# EAGLE design hexciliaSMD (1) (EAGLE 7.3.0)
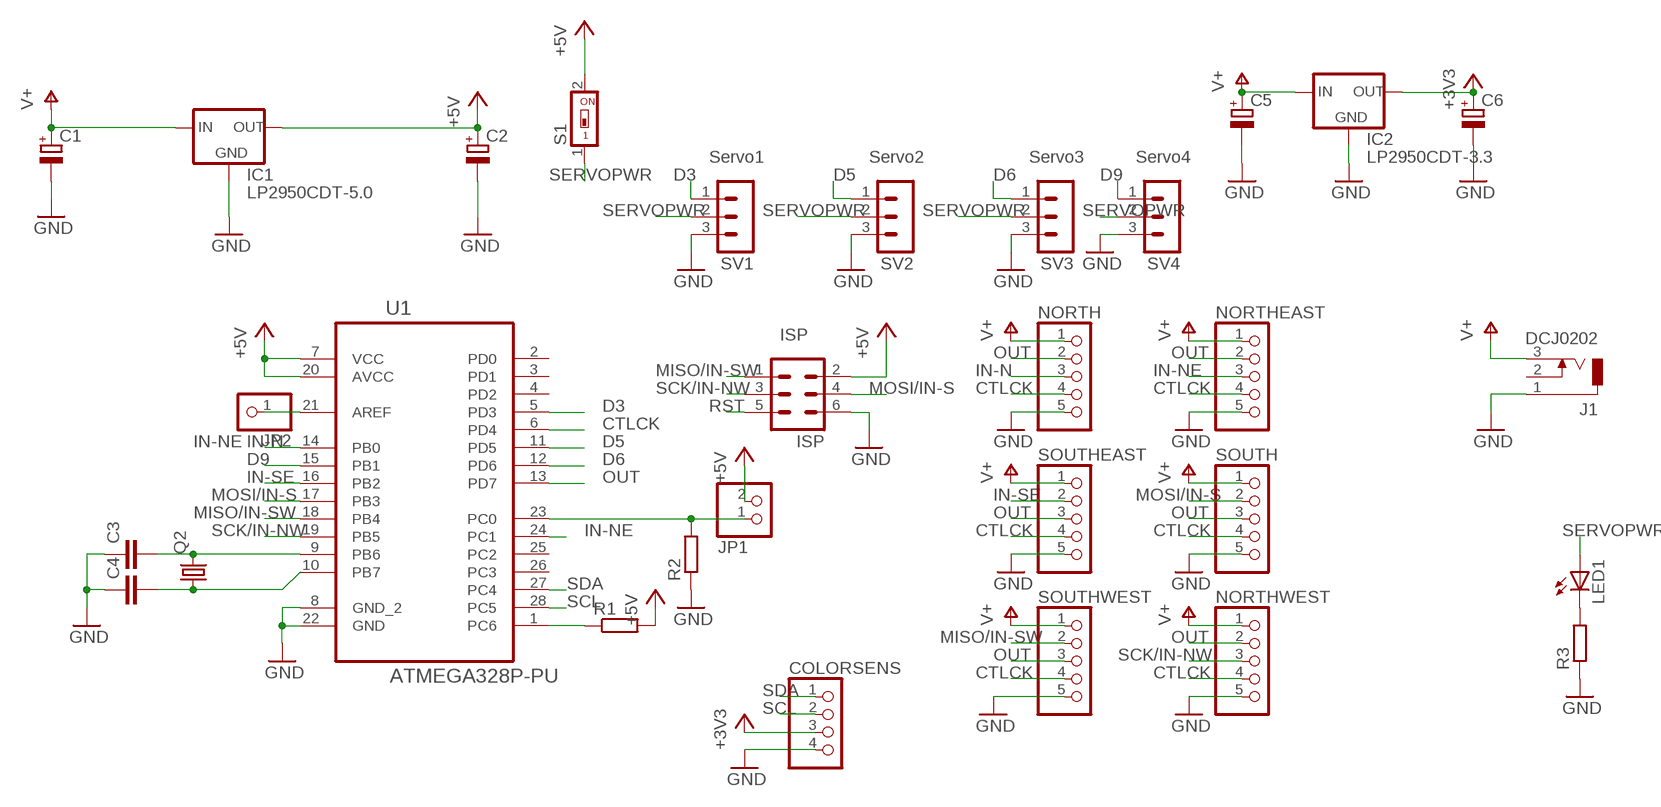
[diagram p0: schematic, sheet 1]

## Parts
C1  CPOL-EU153CLV-0605  [153CLV-0605]
C2  CPOL-EU153CLV-0605  [153CLV-0605]
C3  C-EUC1210  [C1210]
C4  C-EUC1210  [C1210]
C5  CPOL-EU153CLV-0605  [153CLV-0605]
C6  CPOL-EU153CLV-0605  [153CLV-0605]
COLORSENS  PINHD-1X4  [1X04]
IC1  LP2950CDT-5.0  [DPACK]
IC2  LP2950CDT-3.3  [DPACK]
ISP  MA03-2  [MA03-2]
J1  DCJ0202  [DCJ0202]
JP1  PINHD-1X2  [1X02]
JP2  PINHD-1X1  [1X01]
LED1  LEDCHIP-LED0805  [CHIP-LED0805]
NORTH  PINHD-1X5  [1X05]
NORTHEAST  PINHD-1X5  [1X05]
NORTHWEST  PINHD-1X5  [1X05]
Q2  CRYSTALHC49UP  [HC49UP]
R1  R-EU_M1206  [M1206]
R2  R-EU_M1206  [M1206]
R3  R-EU_M1206  [M1206]
S1  SWS001  [SMS-001]
SOUTH  PINHD-1X5  [1X05]
SOUTHEAST  PINHD-1X5  [1X05]
SOUTHWEST  PINHD-1X5  [1X05]
SV1  MA03-1  [MA03-1]
SV2  MA03-1  [MA03-1]
SV3  MA03-1  [MA03-1]
SV4  MA03-1  [MA03-1]
U1  ATMEGA328P-PU  [DIP254P762X457-28]

## Nets
+3V3: C6.+ COLORSENS.3 IC2.3(OUT)
+5V: C2.+ IC1.3(OUT) ISP.2 JP1.2 R1.2 S1.2 U1.7(VCC) U1.20(AVCC)
CONTROLCK: NORTH.4 NORTHEAST.4 NORTHWEST.4 SOUTH.4 SOUTHEAST.4 SOUTHWEST.4 U1.6(PD4)
CTLCHK: JP1.1 R2.2 U1.23(PC0)
D3: SV1.1 U1.5(PD3)
D5: SV2.1 U1.11(PD5)
D6: SV3.1 U1.12(PD6)
D9: SV4.1 U1.15(PB1)
GND: C1.- C2.- C3.1 C4.1 C5.- C6.- COLORSENS.4 IC1.4(GND) IC2.4(GND) ISP.6 J1.1 NORTH.5 NORTHEAST.5 NORTHWEST.5 R2.1 R3.1 SOUTH.5 SOUTHEAST.5 SOUTHWEST.5 SV1.3 SV2.3 SV3.3 SV4.3 U1.8(GND_2) U1.22(GND)
IN-N: NORTH.3 U1.14(PB0)
IN-NE: NORTHEAST.3 U1.24(PC1)
IN-SE: SOUTHEAST.2 U1.16(PB2)
MISO/IN-SW: ISP.1 SOUTHWEST.2 U1.18(PB4)
MOSI/IN-S: ISP.4 SOUTH.2 U1.17(PB3)
N$1: JP2.1 U1.21(AREF)
N$2: LED1.C R3.2
N$3: C3.2 Q2.2 U1.9(PB6)
N$4: C4.2 Q2.1 U1.10(PB7)
OUT: NORTH.2 NORTHEAST.2 NORTHWEST.2 SOUTH.3 SOUTHEAST.3 SOUTHWEST.3 U1.13(PD7)
RST: ISP.5 R1.1 U1.1(PC6)
SCK/IN-NW: ISP.3 NORTHWEST.3 U1.19(PB5)
SCL: COLORSENS.2 U1.28(PC5)
SDA: COLORSENS.1 U1.27(PC4)
SWPWR: LED1.A S1.1 SV1.2 SV2.2 SV3.2 SV4.2
V+: C1.+ C5.+ IC1.1(IN) IC2.1(IN) J1.3 NORTH.1 NORTHEAST.1 NORTHWEST.1 SOUTH.1 SOUTHEAST.1 SOUTHWEST.1
Unconnected: J1.2 U1.2(PD0) U1.3(PD1) U1.4(PD2) U1.25(PC2) U1.26(PC3)

## Notes on the sheet
- Servo1 | Servo2 | Servo3 | Servo4
- SERVOPWR | D3 | D5 | D6 | D9
- SERVOPWR | SERVOPWR | SERVOPWR | SERVOPWR
- ISP
- OUT | OUT
- MISO/IN-SW | IN-N | IN-NE
- SCK/IN-NW | MOSI/IN-S | CTLCK | CTLCK
- D3 | RST
- CTLCK
- IN-NE | IN-N | D5
- D9 | D6
- IN-SE | OUT
- MOSI/IN-S | IN-SE | MOSI/IN-S
- MISO/IN-SW | OUT | OUT
- SCK/IN-NW | IN-NE | CTLCK | CTLCK | SERVOPWR
- SDA
- SCL
- MISO/IN-SW | OUT
- OUT | SCK/IN-NW
- CTLCK | CTLCK
- SDA
- SCL

## Library data of the parts
C1 C2 C5 C6 = rcl:CPOL-EU: POLARIZED CAPACITOR, European symbol
C3 C4 = rcl:C-EU: CAPACITOR, European symbol
COLORSENS = pinhead:PINHD-1X4: PIN HEADER
IC1 IC2 = v-reg:LP2950?*: Source: http://cache.national.com/ds/LP/LP2950.pdf
ISP = con-lstb:MA03-2: PIN HEADER; OC_FARNELL: unknown; OC_NEWARK: unknown
J1 = con-jack:DCJ0202: DC POWER JACK Source: DCJ0202.pdf; OC_FARNELL: unknown; OC_NEWARK: unknown
JP1 = pinhead:PINHD-1X2: PIN HEADER
JP2 = pinhead:PINHD-1X1: PIN HEADER
LED1 = led:LED: LED OSRAM: - CHIPLED LG R971, LG N971, LY N971, LG Q971, LY Q971, LO R971, LY R971 LH N974, LH R974 LS Q976, LO Q976, LY Q976 LO Q996 - Hyper CHIPLED LW Q18S LB Q993, LB Q99A, LB R99A - SideLED LS A670, LO A670, LY A670, LG A670, LP A670 LB A673, LV A673, LT A673, LW A673 LH A674 LY A675 LS A676, LA A676, LO A676, LY A676, LW A676 LS A679, LY A679, LG A679 - Hyper Micro SIDELED® LS Y876, LA Y876, LO Y876, LY Y876 LT Y87S - SmartLED LW L88C, LW L88S LB L89C, LB L89S, LG L890 LS L89K, LO L89K, LY L89K LS L896, LA L896, LO L896, LY L896 - TOPLED LS T670, LO T670, LY T670, LG T670, LP T670 LSG T670, LSP T670, LSY T670, LOP T670, LYG T670 LG T671, LOG T671, LSG T671 LB T673, LV T673, LT T673, LW T673 LH T674 LS T676, LA T676, LO T676, LY T676, LB T676, LH T676, LSB T676, LW T676 LB T67C, LV T67C, LT T67C, LS T67K, LO T67K, LY T67K, LW E67C LS E67B, LA E67B, LO E67B, LY E67B, LB E67C, LV E67C, LT E67C LW T67C LS T679, LY T679, LG T679 LS T770, LO T770, LY T770, LG T770, LP T770 LB T773, LV T773, LT T773, LW T773 LH T774 LS E675, LA E675, LY E675, LS T675 LS T776, LA T776, LO T776, LY T776, LB T776 LHGB T686 LT T68C, LB T68C - Hyper Mini TOPLED® LB M676 - Mini TOPLED Santana® LG M470 LS M47K, LO M47K, LY M47K Source: http://www.osram.convergy.de LUXEON: - LUMILED® LXK2-PW12-R00, LXK2-PW12-S00, LXK2-PW14-U00, LXK2-PW14-V00 LXK2-PM12-R00, LXK2-PM12-S00, LXK2-PM14-U00 LXK2-PE12-Q00, LXK2-PE12-R00, LXK2-PE12-S00, LXK2-PE14-T00, LXK2-PE14-U00 LXK2-PB12-K00, LXK2-PB12-L00, LXK2-PB12-M00, LXK2-PB14-N00, LXK2-PB14-P00, LXK2-PB14-Q00 LXK2-PR12-L00, LXK2-PR12-M00, LXK2-PR14-Q00, LXK2-PR14-R00 LXK2-PD12-Q00, LXK2-PD12-R00, LXK2-PD12-S00 LXK2-PH12-R00, LXK2-PH12-S00 LXK2-PL12-P00, LXK2-PL12-Q00, LXK2-PL12-R00 Source: www.luxeon.com KINGBRIGHT: KA-3528ASYC Source: www.kingbright.com
NORTH NORTHEAST NORTHWEST SOUTH SOUTHEAST SOUTHWEST = pinhead:PINHD-1X5: PIN HEADER
Q2 = crystal:CRYSTAL: CRYSTAL; OC_FARNELL: unknown; OC_NEWARK: unknown
R1-R3 = resistor:R-EU_: RESISTOR, European symbol
S1 = smd-special:SWS001: SMD Dip Switch 1 pol.
SV1-SV4 = con-lstb:MA03-1: PIN HEADER; OC_FARNELL: unknown; OC_NEWARK: unknown
U1 = Atmel_By_element14_Batch_1-00:ATMEGA328P-PU: 8-bit Microcontroller with In-System Programmable Flash; MPN: ATMEGA328P-PU; OC_FARNELL: 1715487; OC_NEWARK: 15R0268; PACKAGE: PDIP-28; SUPPLIER: Atmel

## Board
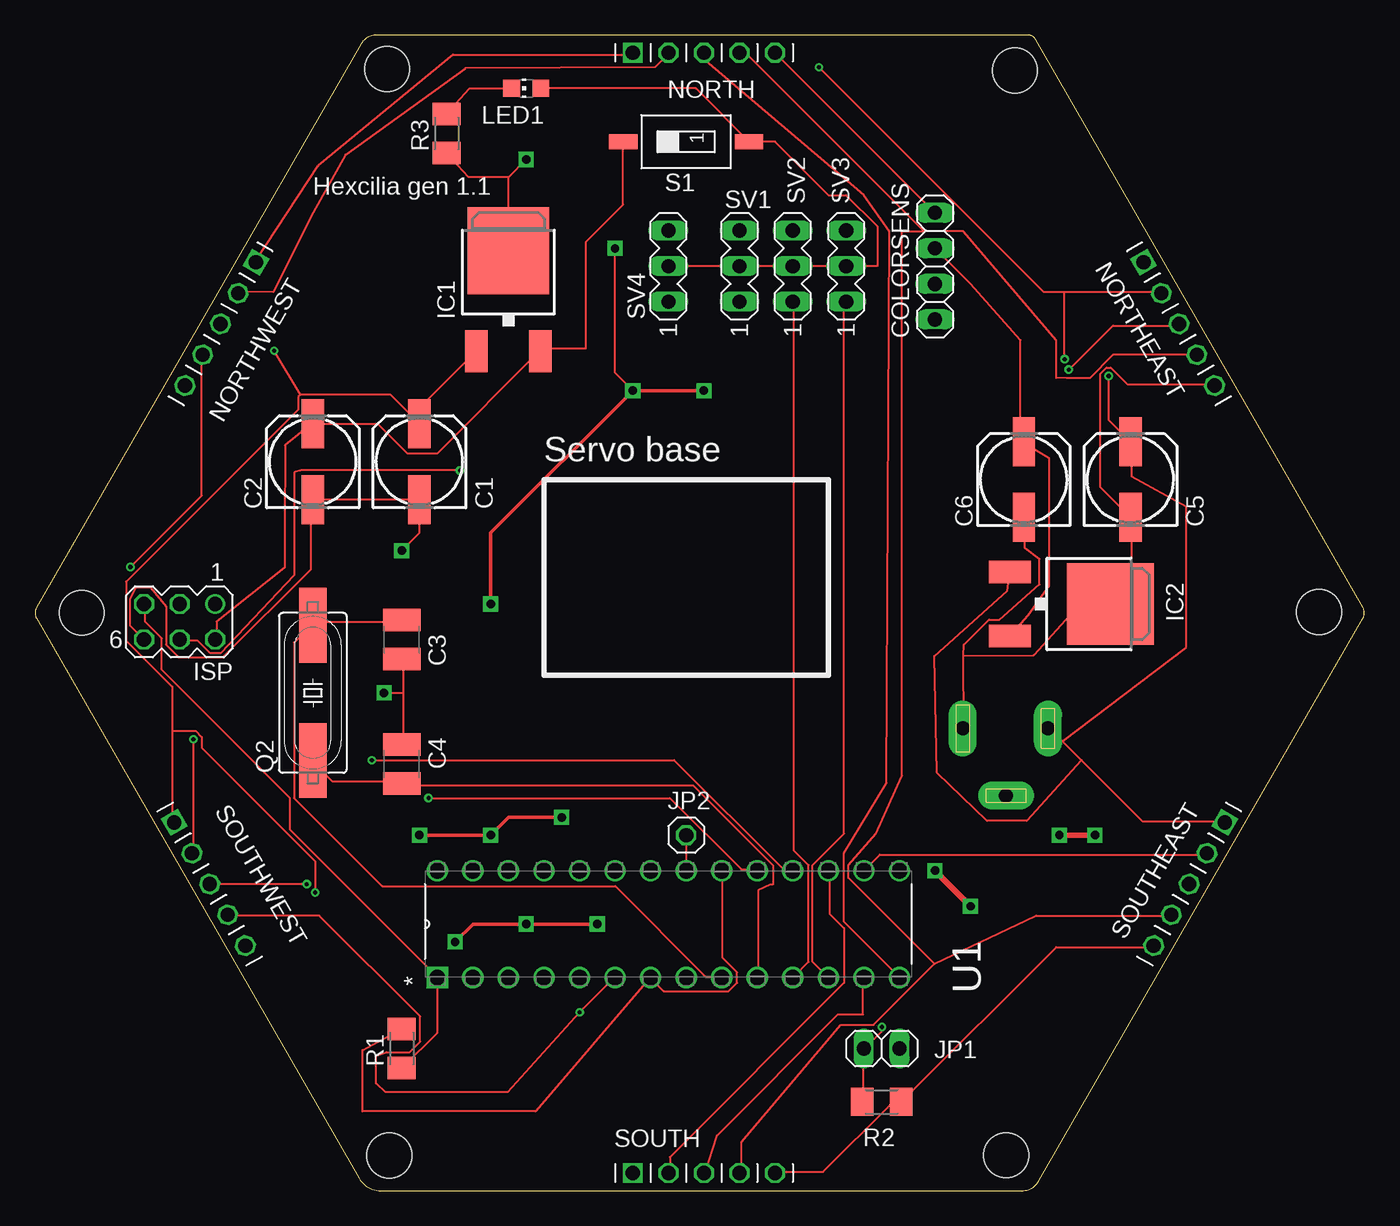
[diagram p1: board, top side]
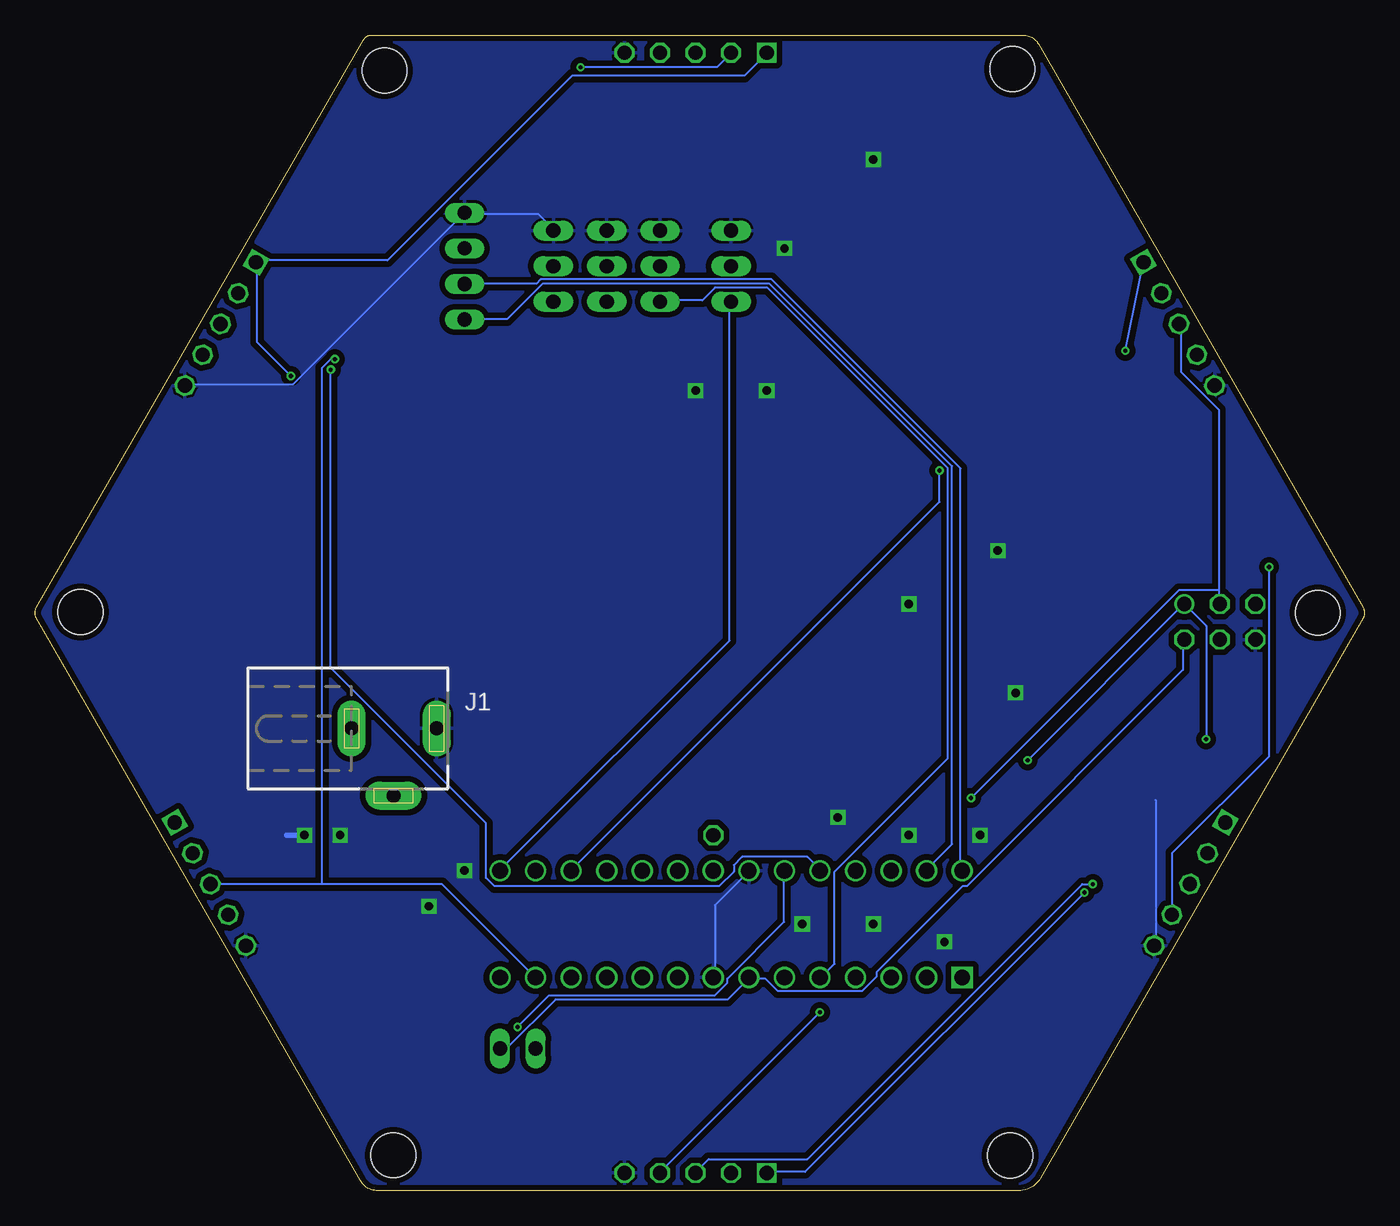
[diagram p2: board, bottom side, seen from below]

Size 95 x 82.55 mm. Coordinates in mm from the lower left corner, seen from the top.
Outline: 71.74,0.72 94.9,40.92 arc60 94.9,41.63 71.52,82.21 arc60 70.94,82.55 24.4,82.55 arc60 23.3,81.91 0.1,41.64 arc60 0.1,40.91 23.15,0.9 arc60 24.7,0 70.5,0 arc60 71.74,0.72
Copper layers (1+2*15+16): Top 0.035mm / dielectric 0.38mm / layer 2 0.035mm / dielectric 0.71mm / layer 15 0.035mm / dielectric 0.38mm / Bottom 0.035mm
Design rules "PCB-POOL Standard_ML4": minimum track width 0.15mm, minimum drill 0.3mm, track to track 0.15mm, track to pad 0.15mm, pad to pad 0.15mm, via to via 0.15mm, smd to smd 0.15mm, copper to edge 0.3mm, drill to drill 0.2mm, minimum pad ring 0.2mm, minimum via ring 0.15mm, stop-mask expansion 0.075mm, vias tented up to drill 0mil, thermal gap 0.2mm
Holes 3.2 mm at 3.35,41.27 69.39,2.54 70.02,80.01 25.16,80.12 91.74,41.34 25.32,2.52

### Footprints (pad centres in the part's own frame; a part is rotated, then mirrored left to right if it is on the bottom)
153CLV-0605 = smd 3.5 x 1.6: + 2.7,0; - -2.7,0
C1210 = smd 1.6 x 2.7: 1 -1.4,0; 2 1.4,0
1X04 = drill 1.016 long: 1 -3.81,0; 2 -1.27,0; 3 1.27,0; 4 3.81,0
DPACK = smd 1.6 x 3: 1 -2.28,-4.8; 3 2.28,-4.8 | smd 5.8 x 6.2: 4 0,2.38
MA03-2 = drill 1.016: 1 -2.54,-1.27 | drill 1.016 octagon: 2 -2.54,1.27; 3 0,-1.27; 4 0,1.27; 5 2.54,-1.27; 6 2.54,1.27
DCJ0202 = drill 1 pad 2 long: 1 0,3.1; 2 4.8,0; 3 0,-3
1X02 = drill 1.016 long: 1 -1.27,0; 2 1.27,0
1X01 = drill 1.016 octagon: 1 0,0
CHIP-LED0805 = smd 1.2 x 1.2: A 0,-1.05; C 0,1.05
1X05 = drill 1.016 square: 1 -5.08,0 | drill 1.016 octagon: 2 -2.54,0; 3 0,0; 4 2.54,0; 5 5.08,0
HC49UP = smd 5.334 x 1.93: 1 -4.826,0; 2 4.826,0
M1206 = smd 1.6 x 2: 1 -1.4,0; 2 1.4,0
SMS-001 = smd 1.092 x 2.007: 1 0,-4.496; 2 0,4.496
MA03-1 = drill 1.016 long: 1 -2.54,0; 2 0,0; 3 2.54,0
DIP254P762X457-28 = drill 1.118 square: 1 -7.62,33.02 | drill 1.118: 2 -7.62,30.48; 3 -7.62,27.94; 4 -7.62,25.4; 5 -7.62,22.86; 6 -7.62,20.32; 7 -7.62,17.78; 8 -7.62,15.24; 9 -7.62,12.7; 10 -7.62,10.16; 11 -7.62,7.62; 12 -7.62,5.08; 13 -7.62,2.54; 14 -7.62,0; 15 0,0; 16 0,2.54; 17 0,5.08; 18 0,7.62; 19 0,10.16; 20 0,12.7; 21 0,15.24; 22 0,17.78; 23 0,20.32; 24 0,22.86; 25 0,25.4; 26 0,27.94; 27 0,30.48; 28 0,33.02

### Placement (x,y rotation side)
C1  27.48,52.07 90 top
C2  19.86,52.07 90 top
C3  26.21,39.37 90 top
C4  26.21,30.48 270 top
C5  78.28,50.8 90 top
C6  70.66,50.8 90 top
COLORSENS  64.31,66.04 90 top
IC1  33.83,64.77 0 top
IC2  74.47,41.91 270 top
ISP  10.33,40.64 180 top
J1  69.39,33.02 270 bottom
JP1  60.5,10.16 0 top
JP2  46.53,25.4 0 top
LED1  35.1,78.74 90 top
NORTH  47.8,81.28 0 top
NORTHEAST  81.74,61.91 300 top
NORTHWEST  13.25,61.91 240 top
Q2  19.86,35.56 90 top
R1  26.21,10.16 90 top
R2  60.5,6.35 180 top
R3  29.42,75.52 90 top
S1  46.53,74.93 90 top
SOUTH  47.8,1.27 0 top
SOUTHEAST  82.47,21.91 240 top
SOUTHWEST  12.49,21.91 300 top
SV1  50.34,66.04 90 top
SV2  54.15,66.04 90 top
SV3  57.96,66.04 90 top
SV4  45.26,66.04 90 top
U1  61.77,22.86 90 top

### Tracks (layer width: path | path; a pad name or v marks a point on that pad's centre or on a via)
+3V3
  Top 0.15: COLORSENS.3 64.42,67.2 64.42,66.75 64.87,66.75 66.85,64.77 70.42,60.75 70.42,53.7 C6.+ 70.72,53.4 72.45,52.35 72.45,43.2 70.94,41.1 IC2.3
  Top 0.254: 70.73,53.49 C6.+ 70.5,53.72
+5V
  Top 0.15: R1.2 26.17,11.55 23.4,10.05 23.4,7.65 23.39,5.67 35.76,5.67 43.87,15.15 U1.7 44.02,15.15 44.92,14.25 49.57,14.25 50.17,14.85 50.17,15.6 49.12,16.65 49.12,22.8 U1.20 | ISP.2 12.97,39.45 12.97,40.65 17.83,44.51 17.84,46.2 17.84,47.18 17.86,53.25 19.72,54.75 C2.+ 19.87,54.75 24.52,54.75 26.62,52.65 28.72,52.65 35.92,59.85 IC1.3 36.22,60.15 39.37,60.15 39.37,67.77 42.03,70.43 S1.2
  Top 0.254: 36.21,60.12 IC1.3 35.99,59.89
  Bottom 0.15: JP1.2 61.72,10.2 61.27,10.2 57.82,13.65 45.52,13.65 44.02,15.15 U1.7 43.87,15.15 42.82,15.15 41.92,14.25 35.92,14.25 34.87,15.3 34.87,15.6 28.72,21.75 28.42,21.75 12.97,37.2 12.97,39.3 ISP.2
CONTROLCK  (via drill 0.3)
  Top 0.15: 63.52,68.55 64.67,68.55 66.32,68.55 72.97,60.75 72.97,58.42 72.96,58.05 73.72,58.05 75.37,58.05 77.02,59.7 82.87,59.7 NORTHEAST.4 | 63.52,68.55 50.92,81.15 50.47,81.15 NORTH.4 | SOUTHWEST.4 13.87,19.65 20.32,19.65 27.52,12.45 27.52,10.65 26.77,9.9 25.12,9.9 24.37,9.63 24.37,7.68 25.05,7.05 33.75,7.05 v38.92,12.75 41.32,15.15 U1.6 | v6.82,44.55 11.92,49.65 11.92,59.7 NORTHWEST.4 | 64.27,16.2 59.92,11.85 57.6,11.85 50.47,3.45 50.47,1.35 SOUTH.4 | 64.27,16.2 71.53,19.65 81.07,19.65 SOUTHEAST.4 | 63.52,68.55 61.95,68.55 61.95,68.22 61.96,29.65 60.09,25.49 58.12,23.25 58.12,22.35 64.27,16.2
  Bottom 0.15: v6.82,44.55 6.82,31.05 13.72,24.15 13.72,19.8 SOUTHWEST.4 | v38.92,12.75 50.32,1.35 SOUTH.4
CTLCHK  (via drill 0.3)
  Top 0.15: R2.2 59.17,6.45 59.17,10.05 JP1.1 59.32,10.2 60.52,11.4 v60.52,11.7
  Top 0.254: 59.07,6.4 R2.2
  Bottom 0.15: v60.52,11.7 58.27,13.95 46.42,13.95 45.52,14.85 45.52,15.15 41.47,19.2 41.47,22.8 U1.23
D3
  Bottom 0.15: SV1.1 50.32,63.6 47.32,63.6 46.42,64.5 42.67,64.5 29.77,51.6 29.77,30.9 37.87,22.8 37.87,16.2 38.77,15.3 U1.5
D5
  Top 0.15: SV2.1 54.22,63.45 54.22,24.3 55.27,23.25 55.27,16.35 54.22,15.3 U1.11
D6
  Top 0.15: SV3.1 57.82,63.45 57.82,25.5 55.57,23.25 55.57,16.35 56.62,15.3 U1.12
D9
  Bottom 0.15: SV4.1 45.37,63.45 45.37,39.3 61.72,22.95 U1.15
GND  (via drill 0.6)
  Top 0.15: 26.32,35.56 26.32,37.95 C3.1 26.47,38.25 26.47,38.55 | 26.32,35.56 26.32,32.1 C4.1 | C1.- 27.52,49.35 27.82,49.05 C1.- | C1.- 27.37,49.35 19.87,49.35 C2.- 19.72,49.05 19.72,44.4 13.42,38.1 10.27,38.1 9.37,39 9.37,41.7 8.22,43.1 7.22,43.11 6.82,42.3 6.82,40.35 7.72,39.45 ISP.6 | SOUTH.5 53.02,1.35 56.32,1.35 61.12,6.15 61.72,6.15 R2.1 62.02,6.45 72.97,17.4 79.87,17.4 SOUTHEAST.5 | 50.32,68.55 SV1.3 50.47,68.55 | 54.22,68.55 SV2.3 54.07,68.55 | 57.82,68.55 SV3.3 | NORTH.5 53.02,81.15 64.27,69.9 COLORSENS.4 | 66.32,38.21 66.37,33.15 J1.1 66.37,33 | 66.32,38.21 66.37,39 68.17,40.8 68.92,40.8 71.77,43.31 71.77,45.11 70.72,45.9 70.72,48 C6.- | 66.32,38.21 71.36,38.25 74.62,41.85 76.72,41.85 IC2.4 78.37,43.5 78.37,48 C5.- 78.22,48.15 76.12,50.25 76.12,58.35 76.57,58.8 76.87,58.8 78.07,57.6 84.22,57.6 NORTHEAST.5 | 33.93,67.21 33.83,67.31 33.83,72.39 | v42.72,57.15 41.45,58.42 v41.45,67.31 | v24.94,35.56 26.32,35.56 | v26.21,45.72 27.48,46.99 C1.- | 33.83,72.39 31,72.39 R3.1 | v35.1,73.66 33.83,72.39
  Top 0.254: 61.82,6.17 R2.1 | 26.38,32 C4.1 26.38,31.77 | 26.38,38.18 C3.1 | 19.75,49.15 C2.- | 33.93,67.21 IC1.4 | 78.28,43.43 76.9,42.06 IC2.4 | v47.8,57.15 v42.72,57.15 32.56,46.99 v32.56,41.91 | v37.64,26.67 33.83,26.67 v32.56,25.4 v27.48,25.4 | v40.18,19.05 v35.1,19.05 31.29,19.05 v30.02,17.78
  Top 0.406: v73.2,25.4 v75.74,25.4 | v66.85,20.32 v64.31,22.86
  Bottom 0.15: 14.92,27.9 14.92,17.55 SOUTHWEST.5 | SV3.3 57.97,68.7 59.02,69.75 64.27,69.75 COLORSENS.4 64.42,69.75 76.57,57.6 84.22,57.6 NORTHEAST.5 | U1.8 46.42,15.3 46.42,20.4 44.02,22.8 U1.22
  Bottom 0.406: v75.74,25.4 77.01,25.4
  pour Bottom (isolate 0.406): 24.3,82.55 70.96,82.55 arc-60 71.5,82.25 94.88,41.67 arc-60 94.88,40.89 71.77,0.78 arc-57 70.5,0 24.71,0 arc-52 23.28,0.7 0.07,40.97 arc-62 0.08,41.61 23.3,81.91 arc-56 24.31,82.55
IN-N
  Top 0.15: NORTH.3 47.92,81.15 47.92,80.7 59.23,71.12 61.04,68.55 60.85,29.12 57.82,24.11 57.82,19.2 61.72,15.3 U1.14
IN-NE  (via drill 0.3)
  Top 0.15: v73.87,58.65 77.02,61.8 81.67,61.8 NORTHEAST.3
  Bottom 0.15: v73.87,58.65 73.87,37.35 62.77,26.25 62.77,22.35 62.17,21.75 46.12,21.75 45.07,22.8 45.07,23.25 44.47,23.85 39.82,23.85 38.92,22.95 U1.24
IN-SE
  Top 0.15: U1.16 60.37,24 83.62,24 SOUTHEAST.2
MISO/IN-SW  (via drill 0.3)
  Top 0.15: v11.32,32.25 11.32,24.15 SOUTHWEST.2 | v24.07,30.75 45.67,30.75 53.47,22.95 54.07,22.95 U1.18
  Bottom 0.15: v11.32,32.25 11.32,40.35 12.82,41.85 ISP.1 12.97,41.85 v24.07,30.75
MOSI/IN-S  (via drill 0.3)
  Top 0.15: v30.37,51.45 18.97,51.45 18.52,51.32 18.52,43.97 13.27,38.4 12.52,38.4 11.62,39.3 10.42,39.3 ISP.4 | SOUTH.2 45.37,1.35 45.37,2.4 57.82,14.85 57.82,18.75 56.77,19.8 56.77,22.8 U1.17
  Bottom 0.15: v30.37,51.45 30.37,49.2 56.62,22.95 U1.17
N$1
  Top 0.15: JP2.1 46.57,25.35 46.57,22.95 U1.21
N$2
  Top 0.15: R3.2 31.07,78.74 LED1.C
N$3
  Top 0.15: C3.2 26.17,40.65 20.17,40.65 20.02,40.5 Q2.2 19.72,40.35 18.52,39.15 18.52,28.05 24.82,21.75 41.47,21.75 47.92,15.3 48.97,15.3 U1.9
  Top 0.254: 19.98,40.46 Q2.2
N$4
  Top 0.15: Q2.1 19.87,30.6 21.22,29.25 26.17,29.25 C4.2 26.47,28.95 47.02,28.95 52.72,23.25 52.72,21.87 52.52,21.87 51.67,21.45 51.67,15.3 U1.10
  Top 0.254: 26.16,29.26 C4.2 26.38,29.03
OUT  (via drill 0.3)
  Top 0.15: NORTHWEST.2 14.62,64.2 17.02,64.19 19.86,69.85 22.18,74.01 30.76,80.18 44.32,80.25 45.22,81.15 NORTH.2 | 73.57,64.2 72.07,64.2 v56.02,80.25 | 73.57,64.2 80.47,64.2 NORTHEAST.2 | v19.42,21.9 12.52,21.9 SOUTHWEST.3 | 59.17,12.6 59.17,15.15 U1.13 | 57.38,12.6 48.71,3.94 47.92,1.35 SOUTH.3 | v73.57,59.4 73.57,64.2
  Top 0.152: 57.38,12.6 59.17,12.6
  Bottom 0.15: v56.02,80.25 46.27,80.25 45.37,81.15 NORTH.2 | 74.47,21.9 65.92,21.9 59.32,15.3 U1.13 | 74.47,21.9 82.42,21.9 SOUTHEAST.3 | v19.42,21.9 20.17,21.9 39.82,2.25 46.87,2.25 47.77,1.35 SOUTH.3 | v73.57,59.4 73.87,59.4 74.47,58.8 74.47,21.9
RST
  Top 0.15: R1.1 26.32,8.85 28.72,11.25 28.72,15.15 U1.1 28.72,15.3 18.22,25.8 18.22,28.05 9.07,37.2 9.07,39.45 7.87,40.65 7.87,41.85 ISP.5
  Top 0.254: 26.16,8.91 R1.1
SCK/IN-NW  (via drill 0.3)
  Top 0.15: v28.12,28.05 45.37,28.05 50.47,22.95 51.52,22.95 U1.19
  Bottom 0.15: 10.42,42.9 10.42,55.8 13.12,58.5 13.12,61.8 NORTHWEST.3 | 10.42,42.9 10.42,42 ISP.3 | v28.12,28.05 13.27,42.9 10.42,42.9
SCL
  Bottom 0.15: COLORSENS.2 64.27,64.8 59.17,64.8 58.87,65.1 42.37,65.1 28.87,51.6 28.87,22.95 U1.28
SDA
  Bottom 0.15: COLORSENS.1 64.27,62.25 61.27,62.25 58.72,64.8 42.52,64.8 29.47,51.75 29.47,24.75 31.27,22.95 U1.27
SWPWR
  Top 0.15: SV4.2 SV1.2 SV2.2 SV3.2 60.18,66.04 60.18,68.9 57.96,71.12 56.69,71.12 52.88,74.93 S1.1 47.21,78.74 LED1.A
V+  (via drill 0.3)
  Top 0.15: v76.72,58.2 76.72,55.05 78.22,53.55 C5.+ 78.37,53.4 78.37,51 82.26,48.87 82.26,38.82 73.42,32.1 | 73.42,32.1 72.52,33 J1.3 | 73.42,32.1 74.77,30.75 | 74.77,30.75 79.12,26.4 84.97,26.4 SOUTHEAST.1 | IC2.1 69.48,42.84 64.25,38.19 64.44,29.85 68.02,26.41 70.87,26.41 74.77,30.75 | 9.82,32.85 9.82,36 6.52,39.3 6.52,43.5 18.82,55.8 18.82,56.7 18.97,56.85 | 9.82,32.85 9.82,26.4 SOUTHWEST.1 | 18.97,56.85 25.42,56.85 26.92,55.35 | 26.92,55.35 27.37,54.9 C1.+ 26.92,55.35 | 18.97,56.85 v17.09,60 | v20.02,21.3 20.02,23.55 11.92,31.65 11.92,32.4 11.47,32.85 9.82,32.85 | NORTH.1 42.67,81.15 29.89,81.15 20.23,73.21 15.82,66.45 NORTHWEST.1 | 26.92,55.35 31.42,59.85 IC1.1
  Bottom 0.15: v76.72,58.2 79.12,60.6 79.12,66.3 NORTHEAST.1 79.12,66.45 69.82,66.45 56.62,79.65 44.32,79.65 42.82,81.15 NORTH.1 | v17.09,60 15.82,66.3 NORTHWEST.1 | v20.02,21.3 39.97,1.35 42.67,1.35 SOUTH.1

### Text on the board
tNames: Hexcilia gen 1.1 | Servo base